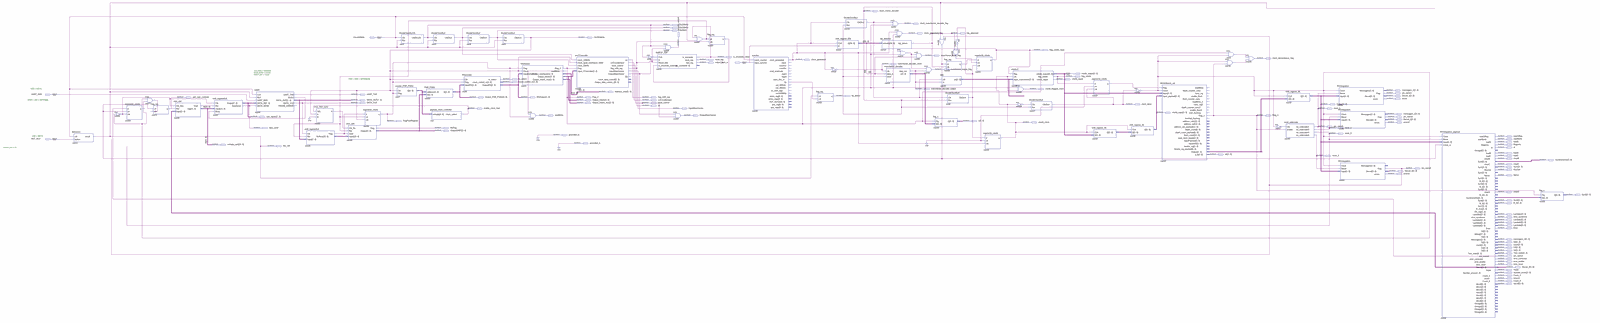
[diagram p0: schematic sheet, whole]
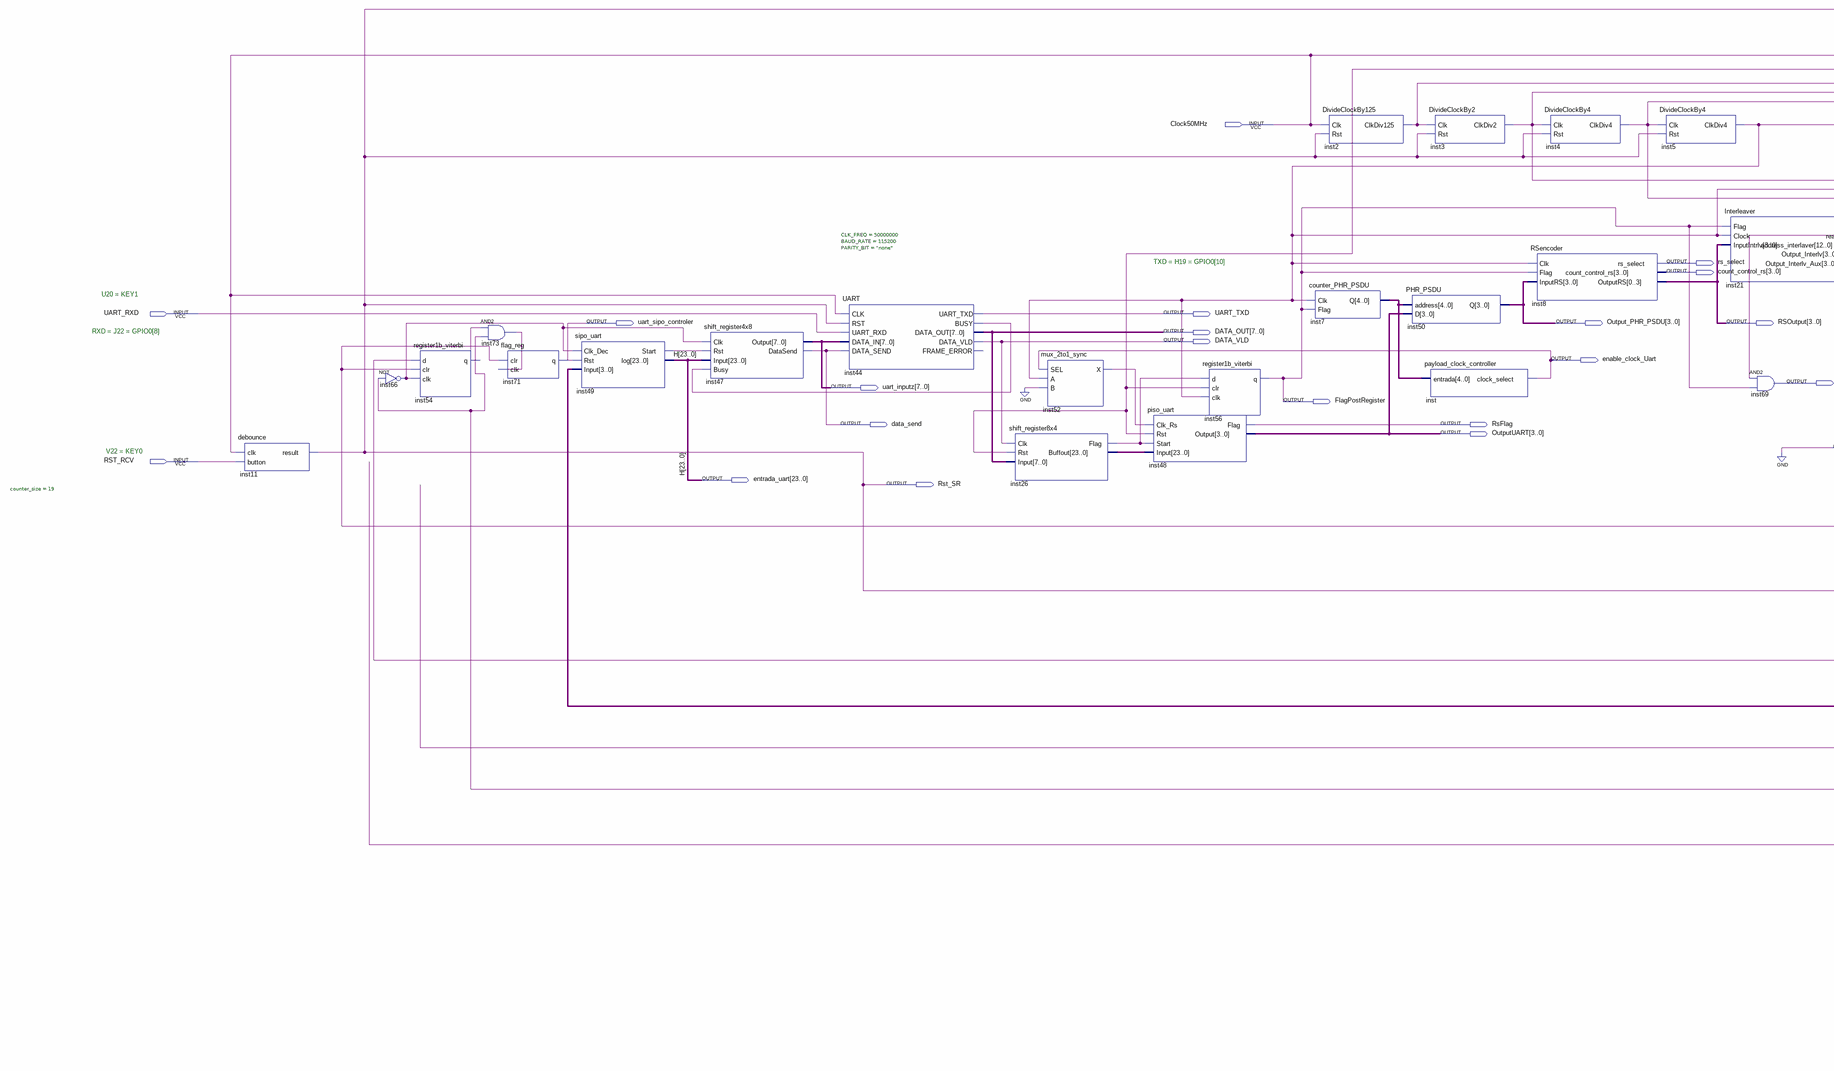
[diagram p1: schematic sheet, left part]
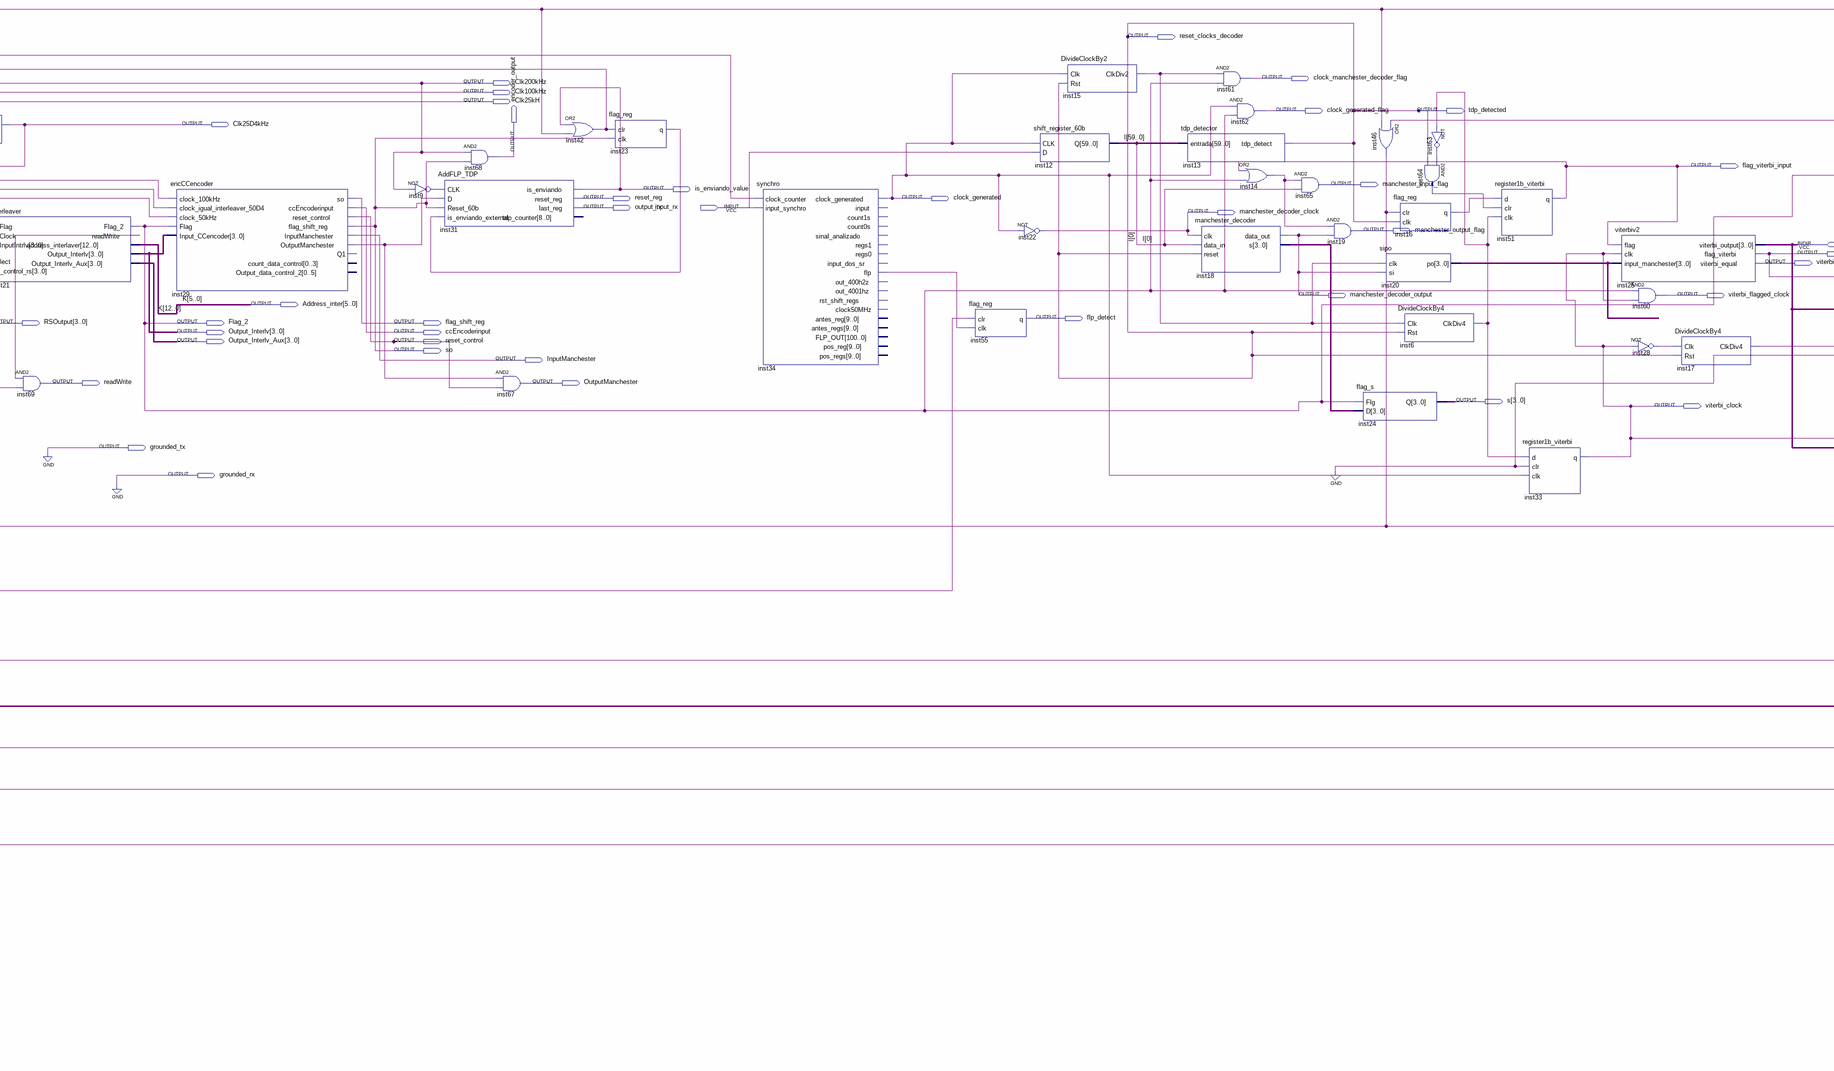
[diagram p2: schematic sheet, centre part]
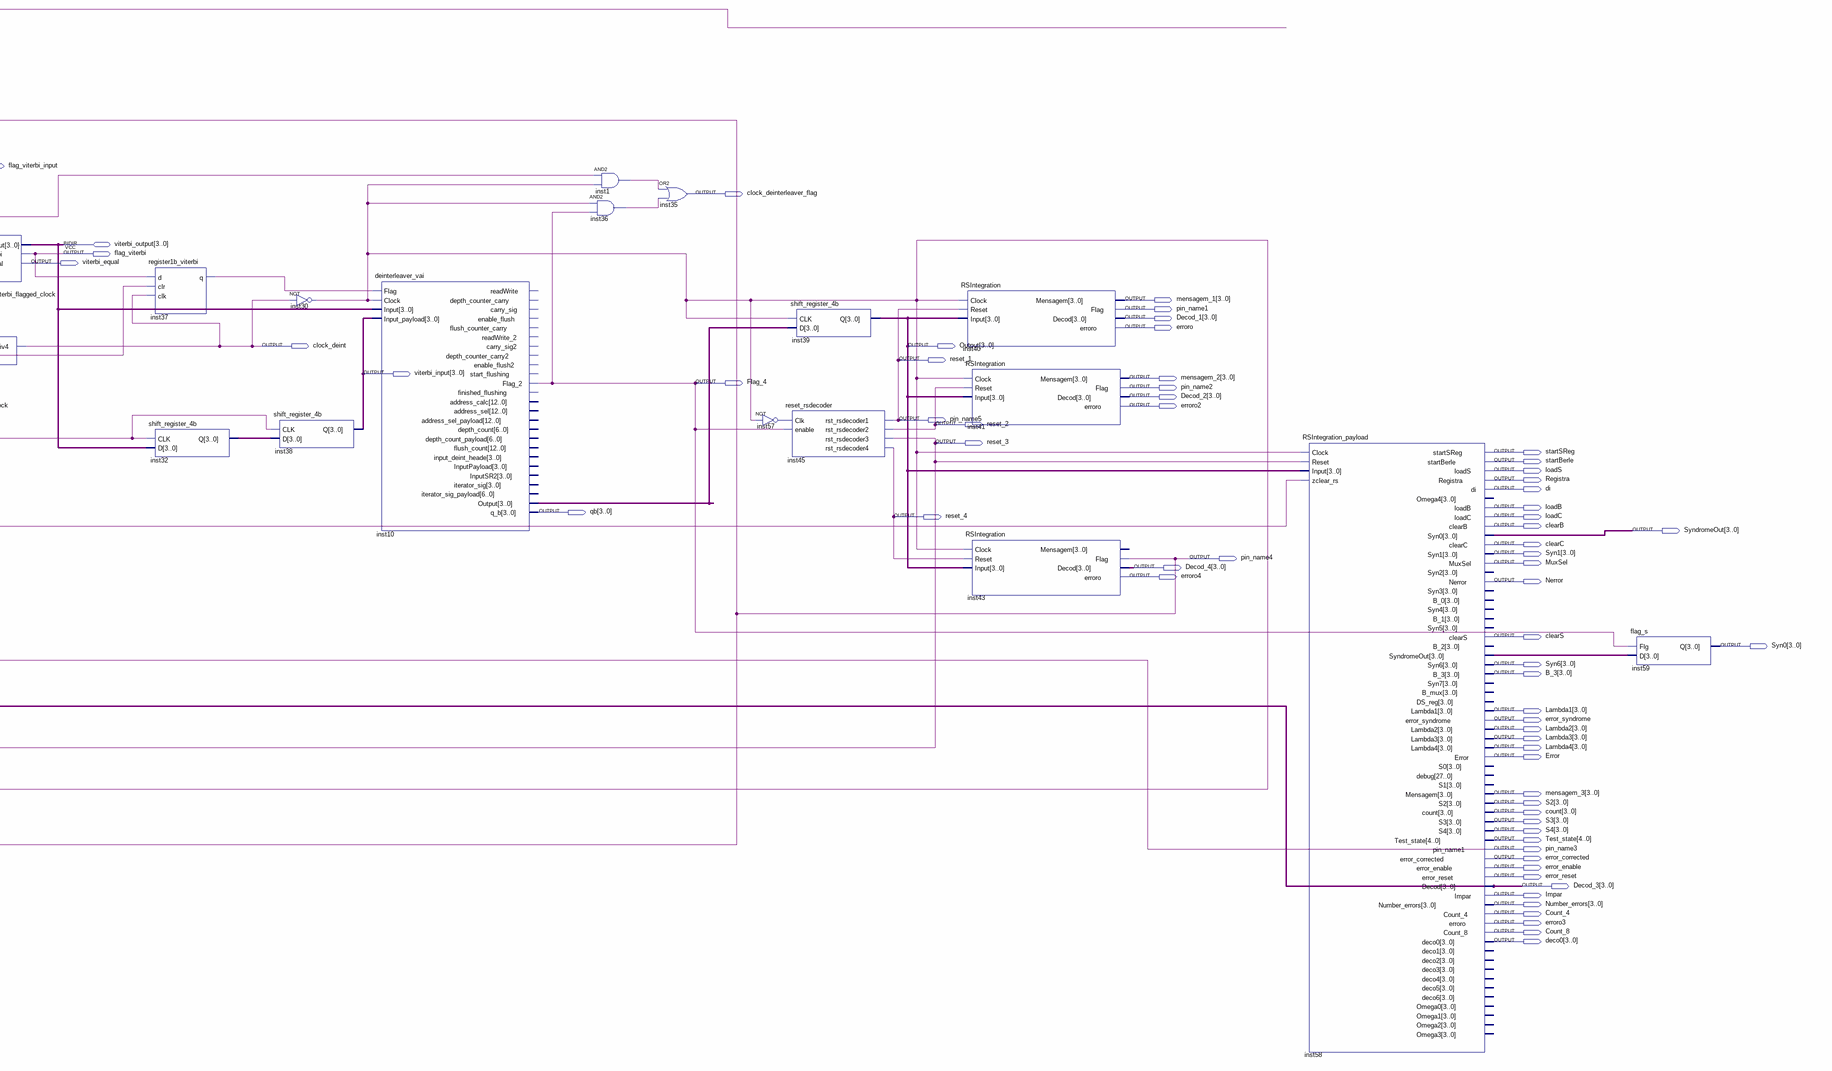
[diagram p3: schematic sheet, right part]
// Quartus schematic all_enc.bdf as structural Verilog: 70 symbols, 120 pins
module all_enc (
  input  Clock50MHz,
  input  input_rx,
  input  UART_RXD,
  input  RST_RCV,
  inout  [3:0] viterbi_output,
  output reset_clocks_decoder,
  output clock_manchester_decoder_flag,
  output Clk200kHz,
  output Clk100kHz,
  output Clk25kH,
  output clock_generated_flag,
  output tdp_detected,
  output Clk25D4kHz,
  output encoder_output,
  output flag_viterbi_input,
  output manchester_input_flag,
  output is_enviando_value,
  output clock_deinterleaver_flag,
  output reset_reg,
  output clock_generated,
  output output_tx,
  output manchester_decoder_clock,
  output manchester_output_flag,
  output flag_viterbi,
  output rs_select,
  output viterbi_equal,
  output [3:0] count_control_rs,
  output manchester_decoder_output,
  output viterbi_flagged_clock,
  output [3:0] mensagem_1,
  output [5:0] Address_inter,
  output pin_name1,
  output UART_TXD,
  output flp_detect,
  output [3:0] Decod_1,
  output uart_sipo_controler,
  output [3:0] Output_PHR_PSDU,
  output [3:0] RSOutput,
  output Flag_2,
  output flag_shift_reg,
  output erroro,
  output [7:0] DATA_OUT,
  output [3:0] Output_Interlv,
  output ccEncoderinput,
  output DATA_VLD,
  output [3:0] Output_Interlv_Aux,
  output reset_control,
  output clock_deint,
  output [3:0] Output,
  output so,
  output enable_clock_Uart,
  output InputManchester,
  output reset_1,
  output [3:0] viterbi_input,
  output [3:0] mensagem_2,
  output readWrite,
  output OutputManchester,
  output Flag_4,
  output [7:0] uart_inputz,
  output pin_name2,
  output [3:0] Decod_2,
  output FlagPostRegister,
  output [3:0] s,
  output viterbi_clock,
  output erroro2,
  output pin_name5,
  output data_send,
  output RsFlag,
  output reset_2,
  output [3:0] OutputUART,
  output reset_3,
  output grounded_tx,
  output startSReg,
  output startBerle,
  output loadS,
  output grounded_rx,
  output [23:0] entrada_uart,
  output Registra,
  output Rst_SR,
  output di,
  output loadB,
  output [3:0] qb,
  output reset_4,
  output loadC,
  output clearB,
  output [3:0] SyndromeOut,
  output clearC,
  output [3:0] Syn1,
  output pin_name4,
  output MuxSel,
  output [3:0] Decod_4,
  output erroro4,
  output Nerror,
  output clearS,
  output [3:0] Syn0,
  output [3:0] Syn6,
  output [3:0] B_3,
  output [3:0] Lambda1,
  output error_syndrome,
  output [3:0] Lambda2,
  output [3:0] Lambda3,
  output [3:0] Lambda4,
  output Error,
  output [3:0] mensagem_3,
  output [3:0] S2,
  output [3:0] count,
  output [3:0] S3,
  output [3:0] S4,
  output [4:0] Test_state,
  output pin_name3,
  output error_corrected,
  output error_enable,
  output error_reset,
  output [3:0] Decod_3,
  output Impar,
  output [3:0] Number_errors,
  output Count_4,
  output erroro3,
  output Count_8,
  output [3:0] deco0
);

  wire inst1_out, inst6_clkdiv4, inst9_out, inst14_out, inst15_clkdiv2, inst16_q, inst21_readwrite, inst23_q,
       inst26_flag, inst28_out, inst29_outputmanchester, inst30_out, inst34_flp, inst36_out, inst37_q,
       inst42_out, inst44_busy, inst46_out, inst49_start, inst52_x, inst54_q, inst57_out, inst63_out,
       inst64_out, inst66_out, inst73_out;
  wire [3:0] inst10_output, inst18_s, inst20_po, inst32_q, inst58_syndromeout;
  wire [4:0] inst7_q;
  wire [12:6] K;
  wire [23:0] inst26_buffout;
  wire [59:0] I;

  debounce #(.counter_size(19)) inst11 (.clk(Clock50MHz), .button(RST_RCV), .result(Rst_SR));
  not inst66 (inst66_out, inst30_out);
  register1b_viterbi inst54 (.d(pin_name3), .clr(inst46_out), .clk(inst66_out), .q(inst54_q));
  and inst73 (inst73_out, inst54_q, inst30_out);
  flag_reg inst71 (.clr(inst46_out), .clk(inst73_out), .q(uart_sipo_controler));
  sipo_uart inst49 (
    .Clk_Dec(inst66_out), .Rst(uart_sipo_controler), .Input(Decod_3), .Start(inst49_start), .log(entrada_uart));
  shift_register4x8 inst47 (
    .Clk(inst66_out), .Rst(inst49_start), .Input(entrada_uart), .Busy(inst44_busy), .Output(uart_inputz),
    .DataSend(data_send));
  UART #(.CLK_FREQ(50000000), .BAUD_RATE(115200), .PARITY_BIT("none")) inst44 (
    .CLK(Clock50MHz), .RST(Rst_SR), .UART_RXD(UART_RXD), .DATA_IN(uart_inputz), .DATA_SEND(data_send),
    .UART_TXD(UART_TXD), .BUSY(inst44_busy), .DATA_OUT(DATA_OUT), .DATA_VLD(DATA_VLD));  // open: FRAME_ERROR
  shift_register8x4 inst26 (
    .Clk(DATA_VLD), .Rst(inst42_out), .Input(DATA_OUT), .Flag(inst26_flag), .Buffout(inst26_buffout));
  mux_2to1_sync inst52 (.SEL(enable_clock_Uart), .A(Clk25D4kHz), .B(1'b0), .X(inst52_x));
  piso_uart inst48 (
    .Clk_Rs(inst52_x), .Rst(inst42_out), .Start(inst26_flag), .Input(inst26_buffout), .Flag(RsFlag),
    .Output(OutputUART));
  register1b_viterbi inst56 (.d(inst26_flag), .clr(inst42_out), .clk(Clk25D4kHz), .q(FlagPostRegister));
  DivideClockBy125 inst2 (.Clk(Clock50MHz), .Rst(Rst_SR), .ClkDiv125(Clk200kHz));
  counter_PHR_PSDU inst7 (.Clk(Clk25D4kHz), .Flag(FlagPostRegister), .Q(inst7_q));
  PHR_PSDU inst50 (.address(inst7_q), .D(OutputUART), .Q(Output_PHR_PSDU));
  DivideClockBy2 inst3 (.Clk(Clk200kHz), .Rst(Rst_SR), .ClkDiv2(Clk100kHz));
  payload_clock_controller inst (.entrada(inst7_q), .clock_select(enable_clock_Uart));
  DivideClockBy4 inst4 (.Clk(Clk100kHz), .Rst(Rst_SR), .ClkDiv4(Clk25kH));
  RSencoder inst8 (
    .Clk(Clk25D4kHz), .Flag(FlagPostRegister), .InputRS(Output_PHR_PSDU), .rs_select(rs_select),
    .count_control_rs(count_control_rs), .OutputRS(RSOutput));
  DivideClockBy4 inst5 (.Clk(Clk25kH), .Rst(Rst_SR), .ClkDiv4(Clk25D4kHz));
  Interleaver inst21 (
    .Flag(FlagPostRegister), .Clock(Clk25D4kHz), .InputIntrlv(RSOutput), .Flag_2(Flag_2),
    .readWrite(inst21_readwrite), .address_interlaver({K, Address_inter}), .Output_Interlv(Output_Interlv),
    .Output_Interlv_Aux(Output_Interlv_Aux));
  and inst69 (readWrite, inst21_readwrite, FlagPostRegister);
  encCCencoder inst29 (
    .clock_100kHz(Clk100kHz), .clock_igual_interleaver_50D4(Clk25D4kHz), .clock_50kHz(Clk25kH),
    .Flag(Flag_2), .Input_CCencoder(Output_Interlv), .so(flag_shift_reg), .ccEncoderinput(ccEncoderinput),
    .reset_control(reset_control), .flag_shift_reg(so), .InputManchester(InputManchester),
    .OutputManchester(inst29_outputmanchester));  // open: Q1, count_data_control, Output_data_control_2
  not inst9 (inst9_out, Clk200kHz);
  AddFLP_TDP inst31 (
    .CLK(inst9_out), .D(inst29_outputmanchester), .Reset_60b(so), .is_enviando_external(inst23_q),
    .is_enviando(is_enviando_value), .reset_reg(reset_reg), .last_reg(output_tx));  // open: tdp_counter
  and inst68 (encoder_output, Clk200kHz, so);
  and inst67 (OutputManchester, inst29_outputmanchester, reset_control);
  or inst42 (inst42_out, is_enviando_value, Rst_SR);
  flag_reg inst23 (.clr(inst42_out), .clk(so), .q(inst23_q));
  synchro inst34 (
    .clock_counter(Clock50MHz), .input_synchro(input_rx), .clock_generated(clock_generated), .flp(inst34_flp));  // open: input, count1s, count0s, sinal_analizado, regs1, regs0, input_dos_sr, out_400h2z, out_4001hz, rst_shift_regs, clock50MHz, antes_reg, antes_regs, FLP_OUT, pos_reg, pos_regs
  flag_reg inst55 (.clr(Rst_SR), .clk(inst34_flp), .q(flp_detect));
  shift_register_60b inst12 (.CLK(clock_generated), .D(input_rx), .Q(I));
  not inst22 (manchester_decoder_clock, clock_generated);
  DivideClockBy2 inst15 (.Clk(clock_generated), .Rst(reset_clocks_decoder), .ClkDiv2(inst15_clkdiv2));
  tdp_detector inst13 (.entrada(I), .tdp_detect(reset_clocks_decoder));
  and inst61 (clock_manchester_decoder_flag, inst15_clkdiv2, Flag_2);
  manchester_decoder inst18 (
    .clk(manchester_decoder_clock), .data_in(I[0]), .reset(reset_clocks_decoder),
    .data_out(manchester_decoder_output), .s(inst18_s));
  and inst62 (clock_generated_flag, clock_generated, Flag_2);
  or inst14 (inst14_out, flag_viterbi_input, Flag_2);
  and inst65 (manchester_input_flag, inst14_out, I[0]);
  and inst19 (manchester_output_flag, inst14_out, manchester_decoder_output);
  flag_s inst24 (.Flg(Flag_2), .D(inst18_s), .Q(s));
  or inst46 (inst46_out, pin_name4, Rst_SR);
  flag_reg inst16 (.clr(inst46_out), .clk(reset_clocks_decoder), .q(inst16_q));
  sipo inst20 (.clk(inst15_clkdiv2), .si(manchester_decoder_output), .po(inst20_po));
  DivideClockBy4 inst6 (.Clk(inst15_clkdiv2), .Rst(reset_clocks_decoder), .ClkDiv4(inst6_clkdiv4));
  not inst63 (inst63_out, inst6_clkdiv4);
  and inst64 (inst64_out, inst63_out, reset_clocks_decoder);
  register1b_viterbi inst51 (.d(inst16_q), .clr(inst64_out), .clk(inst6_clkdiv4), .q(flag_viterbi_input));
  register1b_viterbi inst33 (.d(inst6_clkdiv4), .clr(1'b0), .clk(clock_generated), .q(viterbi_clock));
  viterbiv2 inst25 (
    .flag(flag_viterbi_input), .clk(viterbi_clock), .input_manchester(inst20_po),
    .flag_viterbi(flag_viterbi), .viterbi_equal(viterbi_equal), .viterbi_output(viterbi_output));
  and inst60 (viterbi_flagged_clock, Flag_2, viterbi_clock);
  not inst28 (inst28_out, viterbi_clock);
  DivideClockBy4 inst17 (.Clk(inst28_out), .Rst(reset_clocks_decoder), .ClkDiv4(clock_deint));
  register1b_viterbi inst37 (.d(flag_viterbi), .clr(1'b0), .clk(clock_deint), .q(inst37_q));
  shift_register_4b inst32 (.CLK(viterbi_clock), .D(viterbi_output), .Q(inst32_q));
  not inst30 (inst30_out, clock_deint);
  shift_register_4b inst38 (.CLK(viterbi_clock), .D(inst32_q), .Q(viterbi_input));
  deinterleaver_vai inst10 (
    .Flag(inst37_q), .Clock(inst30_out), .Input(viterbi_output), .Input_payload(viterbi_input),
    .Flag_2(Flag_4), .Output(inst10_output), .q_b(qb));  // open: readWrite, depth_counter_carry, carry_sig, enable_flush, flush_counter_carry, readWrite_2, carry_sig2, depth_counter_carry2, enable_flush2, start_flushing, finished_flushing, address_calc, address_sel, address_sel_payload, depth_count, depth_count_payload, flush_count, input_deint_heade, InputPayload, InputSR2, iterator_sig, iterator_sig_payload
  and inst1 (inst1_out, Flag_2, inst30_out);
  and inst36 (inst36_out, inst30_out, Flag_4);
  or inst35 (clock_deinterleaver_flag, inst1_out, inst36_out);
  not inst57 (inst57_out, inst30_out);
  shift_register_4b inst39 (.CLK(inst30_out), .D(inst10_output), .Q(Output));
  reset_rsdecoder inst45 (
    .Clk(inst57_out), .enable(Flag_4), .rst_rsdecoder1(pin_name5), .rst_rsdecoder2(reset_2),
    .rst_rsdecoder3(reset_3), .rst_rsdecoder4(reset_4));
  RSIntegration inst40 (
    .Clock(inst30_out), .Reset(pin_name5), .Input(Output), .Mensagem(mensagem_1), .Flag(pin_name1),
    .Decod(Decod_1), .erroro(erroro));
  RSIntegration inst41 (
    .Clock(inst30_out), .Reset(reset_2), .Input(Output), .Mensagem(mensagem_2), .Flag(pin_name2),
    .Decod(Decod_2), .erroro(erroro2));
  RSIntegration inst43 (
    .Clock(inst30_out), .Reset(reset_4), .Input(Output), .Flag(pin_name4), .Decod(Decod_4), .erroro(erroro4));  // open: Mensagem
  RSIntegration_payload inst58 (
    .Clock(inst30_out), .Reset(reset_3), .Input(Output), .zclear_rs(inst46_out), .startSReg(startSReg),
    .startBerle(startBerle), .loadS(loadS), .Registra(Registra), .di(di), .loadB(loadB), .loadC(loadC),
    .clearB(clearB), .Syn0(SyndromeOut), .clearC(clearC), .Syn1(Syn1), .MuxSel(MuxSel), .Nerror(Nerror),
    .clearS(clearS), .SyndromeOut(inst58_syndromeout), .Syn6(Syn6), .B_3(B_3), .Lambda1(Lambda1),
    .error_syndrome(error_syndrome), .Lambda2(Lambda2), .Lambda3(Lambda3), .Lambda4(Lambda4), .Error(Error),
    .Mensagem(mensagem_3), .S2(S2), .count(count), .S3(S3), .S4(S4), .Test_state(Test_state),
    .pin_name1(pin_name3), .error_corrected(error_corrected), .error_enable(error_enable),
    .error_reset(error_reset), .Decod(Decod_3), .Impar(Impar), .Number_errors(Number_errors),
    .Count_4(Count_4), .erroro(erroro3), .Count_8(Count_8), .deco0(deco0));  // open: Omega4, Syn2, Syn3, B_0, Syn4, B_1, Syn5, B_2, Syn7, B_mux, DS_reg, S0, debug, S1, deco1, deco2, deco3, deco4, deco5, deco6, Omega0, Omega1, Omega2, Omega3
  flag_s inst59 (.Flg(Flag_4), .D(inst58_syndromeout), .Q(Syn0));

  assign grounded_rx = 1'b0;
  assign grounded_tx = 1'b0;
  assign reset_1 = pin_name5;
  assign tdp_detected = reset_clocks_decoder;

  // Other names for the same wires on the sheet: H[23:0] = entrada_uart; K[5:0] = Address_inter

  // Notes on the sheet:
  //   TXD = H19 = GPIO0[10]
  //   U20 = KEY1
  //   RXD = J22 = GPIO0[8]
  //   V22 = KEY0
endmodule
